# EasyEDA Pro project projeto.eprj

# Schematic Schematic1
Board Name: Board1; Create Date: 2025-10-07; Page Name: P1; Project Name: projeto; Schematic Name: Schematic1; Update Date: 2025-10-07; Company: EasyEDA.com; Page Size: A4; Version: V1.0
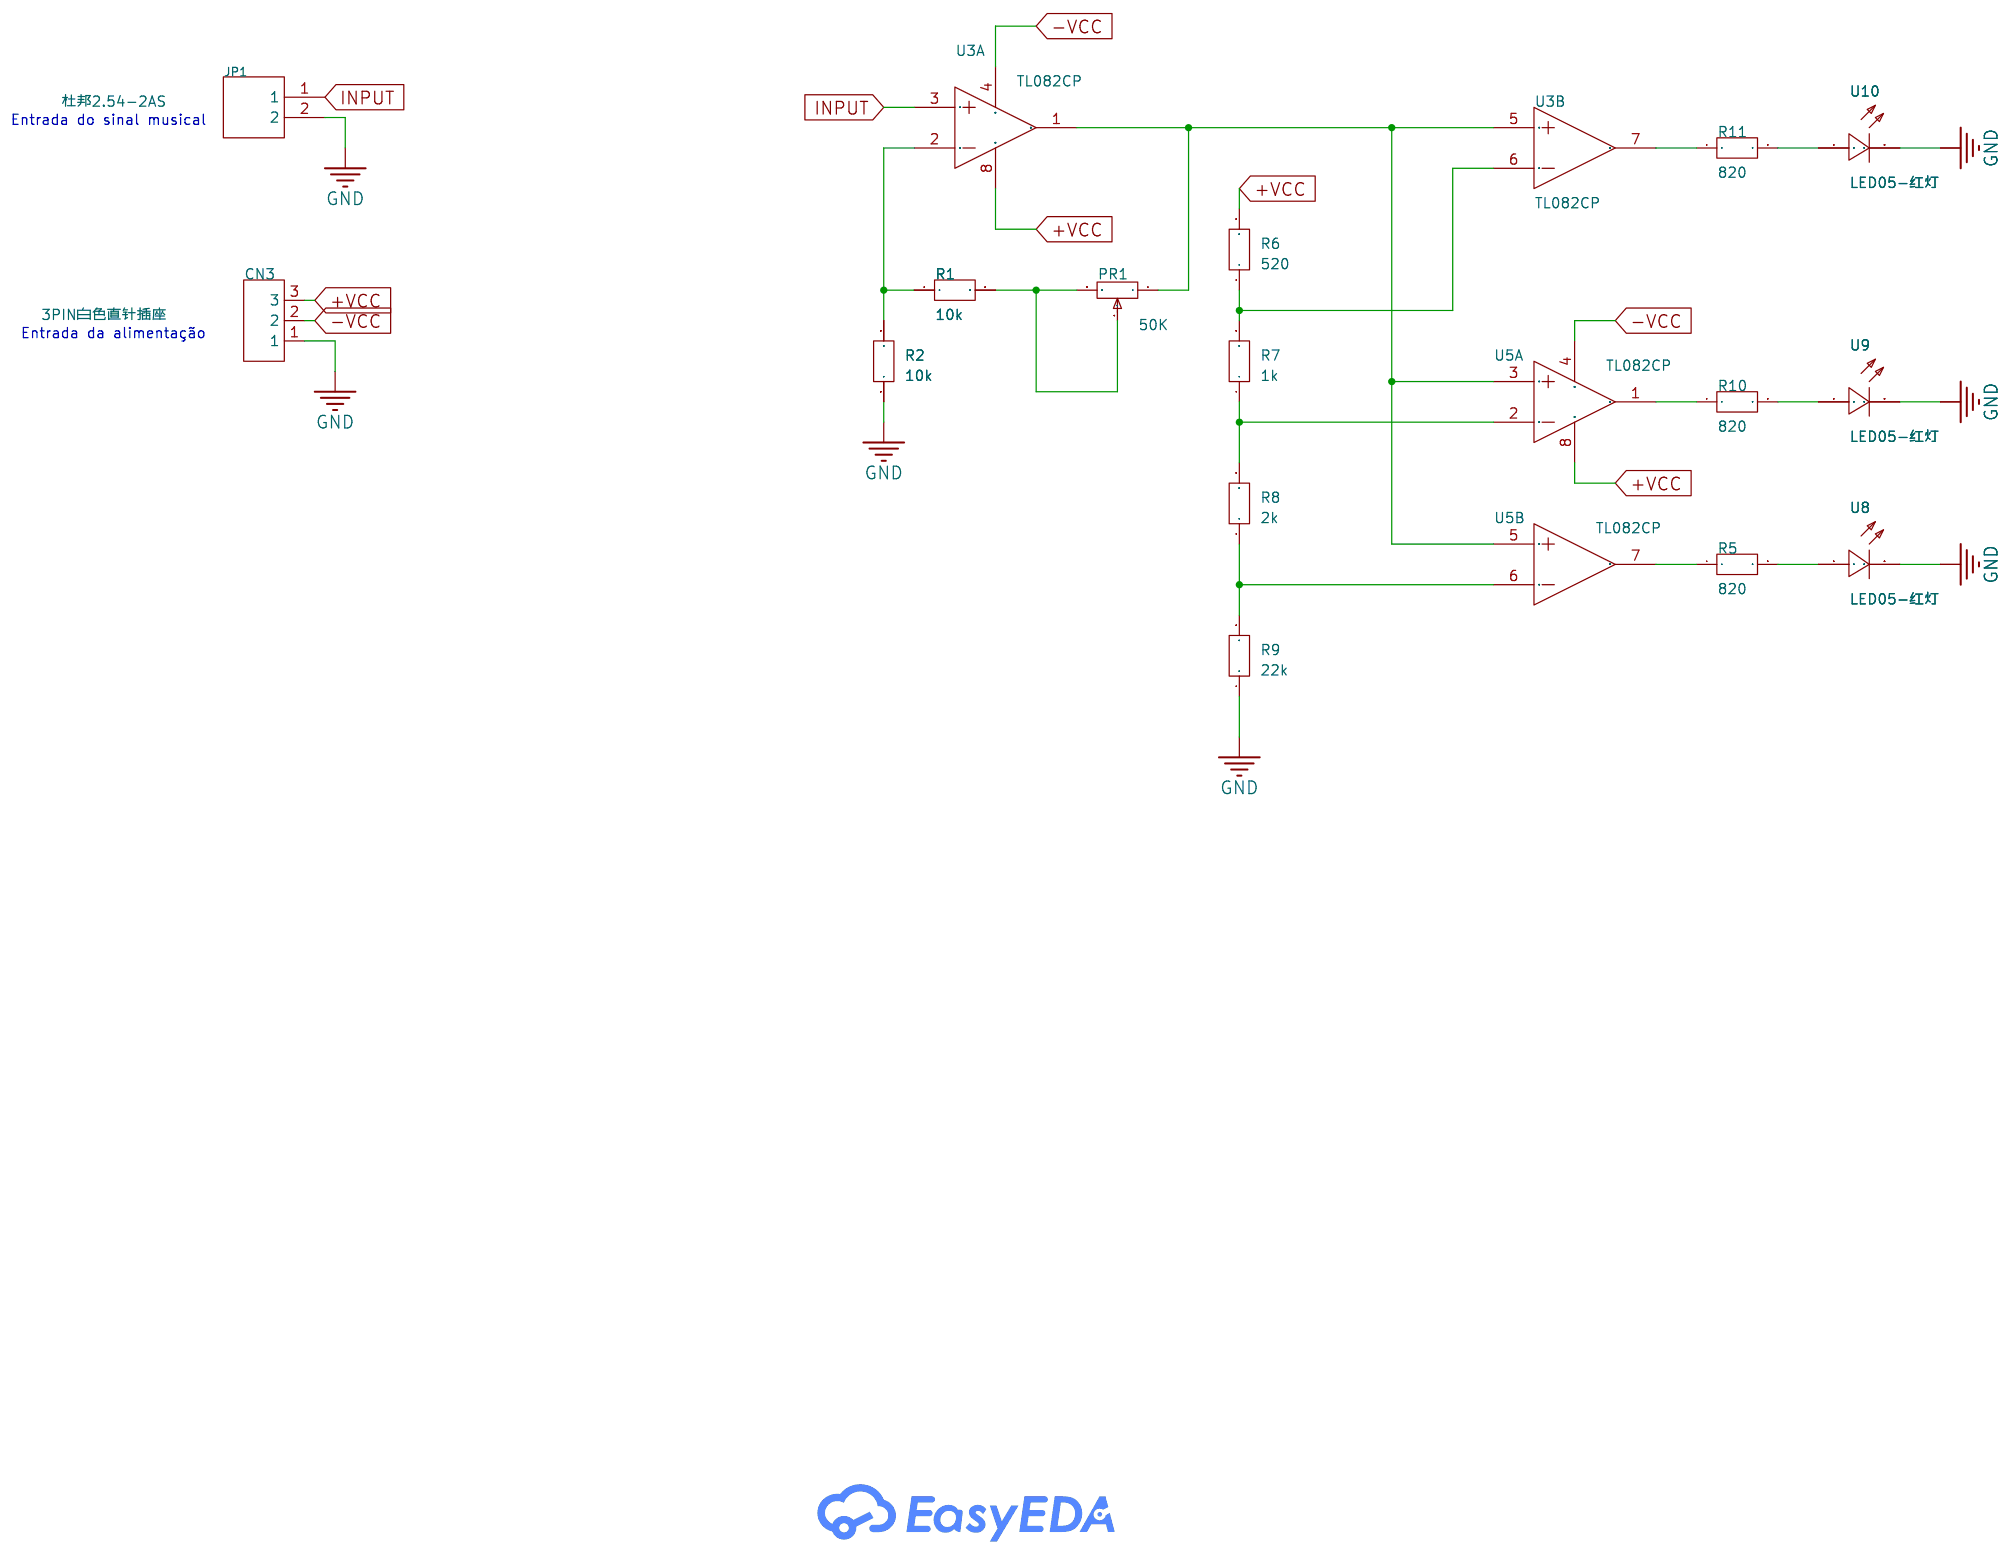
[diagram p0: schematic sheet]

## Parts
CN3  3PIN白色直针插座  [CONN-TH_3P-P2.50_3PIN]
JP1  杜邦2.54-2AS  [CONN-TH_2P-L7.6-W6.0-P2.54-V]
PR1  50K  [CONN-TH_3P-P2.50_3PIN]
R1  10k  [RES-TH_BD4.5-L11.5-P15.50-D0.7]
R2  10k  [RES-TH_BD4.5-L11.5-P15.50-D0.7]
R5  820  [RES-TH_BD4.5-L11.5-P15.50-D0.7]
R6  520  [RES-TH_BD4.5-L11.5-P15.50-D0.7]
R7  1k  [RES-TH_BD4.5-L11.5-P15.50-D0.7]
R8  2k  [RES-TH_BD4.5-L11.5-P15.50-D0.7]
R9  22k  [RES-TH_BD4.5-L11.5-P15.50-D0.7]
R10  820  [RES-TH_BD4.5-L11.5-P15.50-D0.7]
R11  820  [RES-TH_BD4.5-L11.5-P15.50-D0.7]
U3  TL082CP  [PDIP-8_L9.6-W6.4-P2.54-LS7.6-BL]  (sections 1,2)
U5  TL082CP  [PDIP-8_L9.6-W6.4-P2.54-LS7.6-BL]  (sections 1,2)
U8  LED05-红灯  [LED-TH_LED-3MM_RED]
U9  LED05-红灯  [LED-TH_LED-3MM_RED]
U10  LED05-红灯  [LED-TH_LED-3MM_RED]

## Library data of the parts
CN3 = 3PIN白色直针插座: Supplier Part: C9900004958; Supplier Footprint: XH2.54MM; JLCPCB Part Class: Extended Part; Supplier: LCSC
JP1 = 杜邦2.54-2AS: LCSC Part Name: 1x2P 间距:2.54mm 直插; Supplier Part: C50129; Manufacturer: BOOMELE(博穆精密); Supplier Footprint: 插件,P=2.54mm; JLCPCB Part Class: Extended Part; Datasheet: https://item.szlcsc.com/datasheet/%25E6%259D%259C%25E9%2582%25A62.54-2AS/51138.html; Supplier: LCSC; Pins Structure: 1x2P; Pitch: 2.54mm; Mounting Type: Through Hole; Number of Pins: 2P; Number of Rows: 1; Number of PINs Per Row: 2; Current Rating: 3A; Operating Temperature: -25℃~+85℃
PR1 = R_3386P: Supplier Footprint: Through
R1 R2 R5-R11 = MOR02SJ075KA10: Supplier Part: C37390378; Manufacturer: UNI-ROYAL(厚声); Supplier Footprint: 插件,D4.5xL11.5mm; Datasheet: https://item.szlcsc.com/datasheet/MOR02SJ075KA10/39119316.html; Supplier: LCSC; Type: Metal Oxide Film Resistor; Tolerance: ±5%; Power(Watts): 2W; Temperature Coefficient: ±350ppm/℃
U3 U5 = TL082CP: LCSC Part Name: JFET 输入运算放大器; Supplier Part: C75052; Manufacturer: TI(德州仪器); Supplier Footprint: DIP-8; JLCPCB Part Class: Extended Part; Datasheet: https://www.ti.com/cn/lit/gpn/tl082; Supplier: LCSC; Number of Circuits: Dual channel; Gain Bandwidth Product(GBP): 3MHz; Current - Input Bias(Ib): 30pA; Voltage - Input Offset(Vos): 5mV; Slew Rate(SR): 13V/us; Supply Voltage: 5V~15V; Supply Current Per Channel: 1.4mA; Output Current: 2.8mA; Operating Temperature: 0℃~+70℃
U8-U10 = LED05-红灯: Supplier Part: C9900009041; Supplier Footprint: THrough hole; JLCPCB Part Class: Extended Part; Supplier: LCSC

## Nets
+VCC: CN3.3 R6.2 U3.8(VCC+) U5.8(VCC+)
-VCC: CN3.2 U3.4(VCC-) U5.4(VCC-)
GND: CN3.1 JP1.2 R2.1 R9.1 U8.2 U9.2 U10.2
INPUT: JP1.1 U3.3(IN1+)
$1N1297: PR1.2 PR1.3 R1.2
$1N1317: R1.1 R2.2 U3.2(IN1-)
$1N1323: PR1.1 U3.1(OUT1) U3.5(IN2+) U5.3(IN1+) U5.5(IN2+)
$1N1988: R5.1 U5.7(OUT2)
$1N2063: R6.1 R7.2 U3.6(IN2-)
$1N2071: R7.1 R8.2 U5.2(IN1-)
$1N2146: R8.1 R9.2 U5.6(IN2-)
$1N2434: R5.2 U8.1
$1N2538: R10.1 U5.1(OUT1)
$1N2540: R10.2 U9.1
$1N2621: R11.1 U3.7(OUT2)
$1N2623: R11.2 U10.1

## Notes on the sheet
- Entrada do sinal musical
- Entrada da alimentação

# Board PCB1
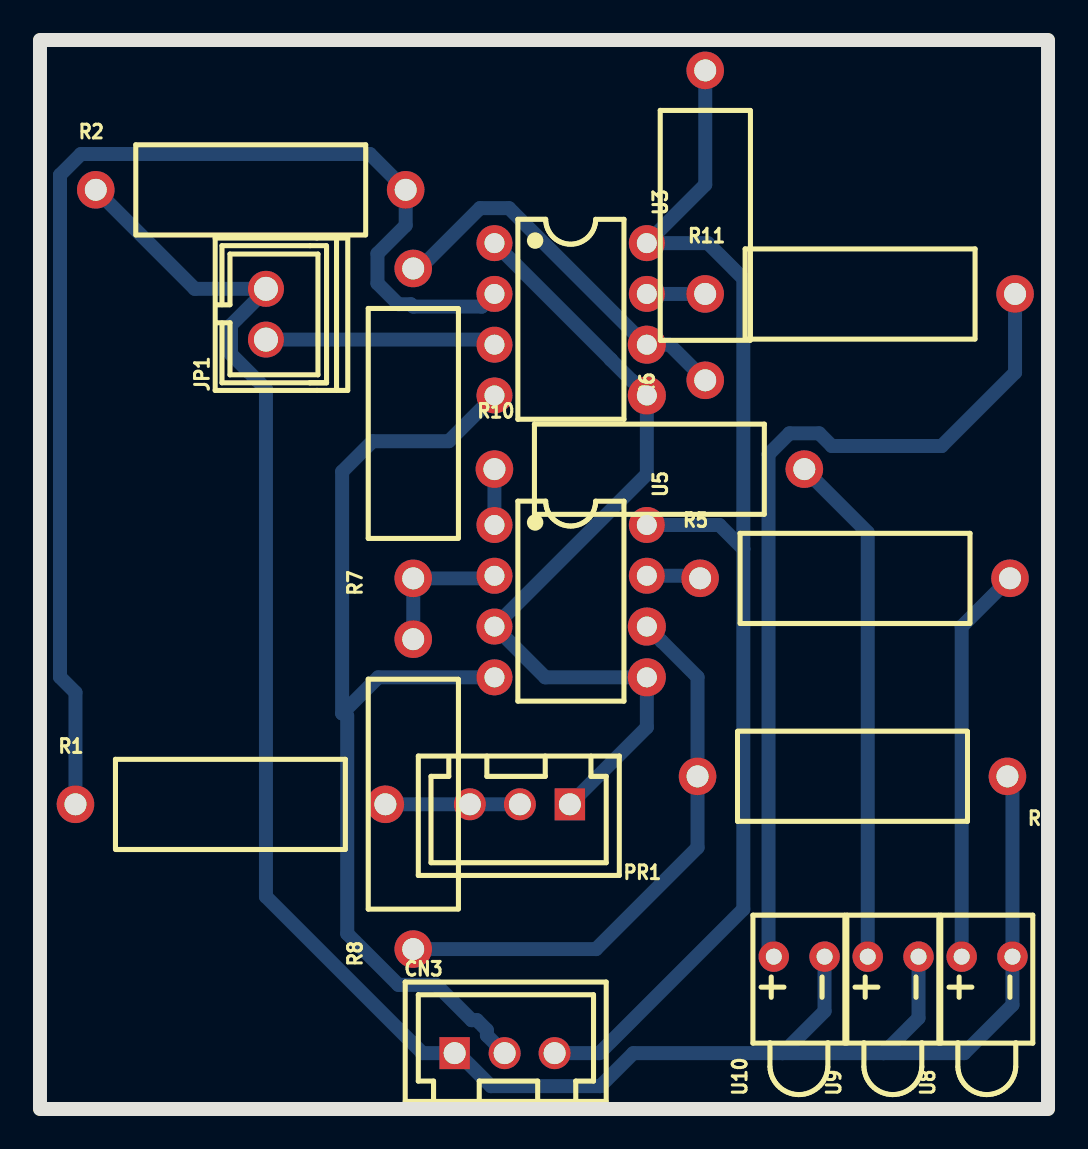
[diagram p1: board, top side]
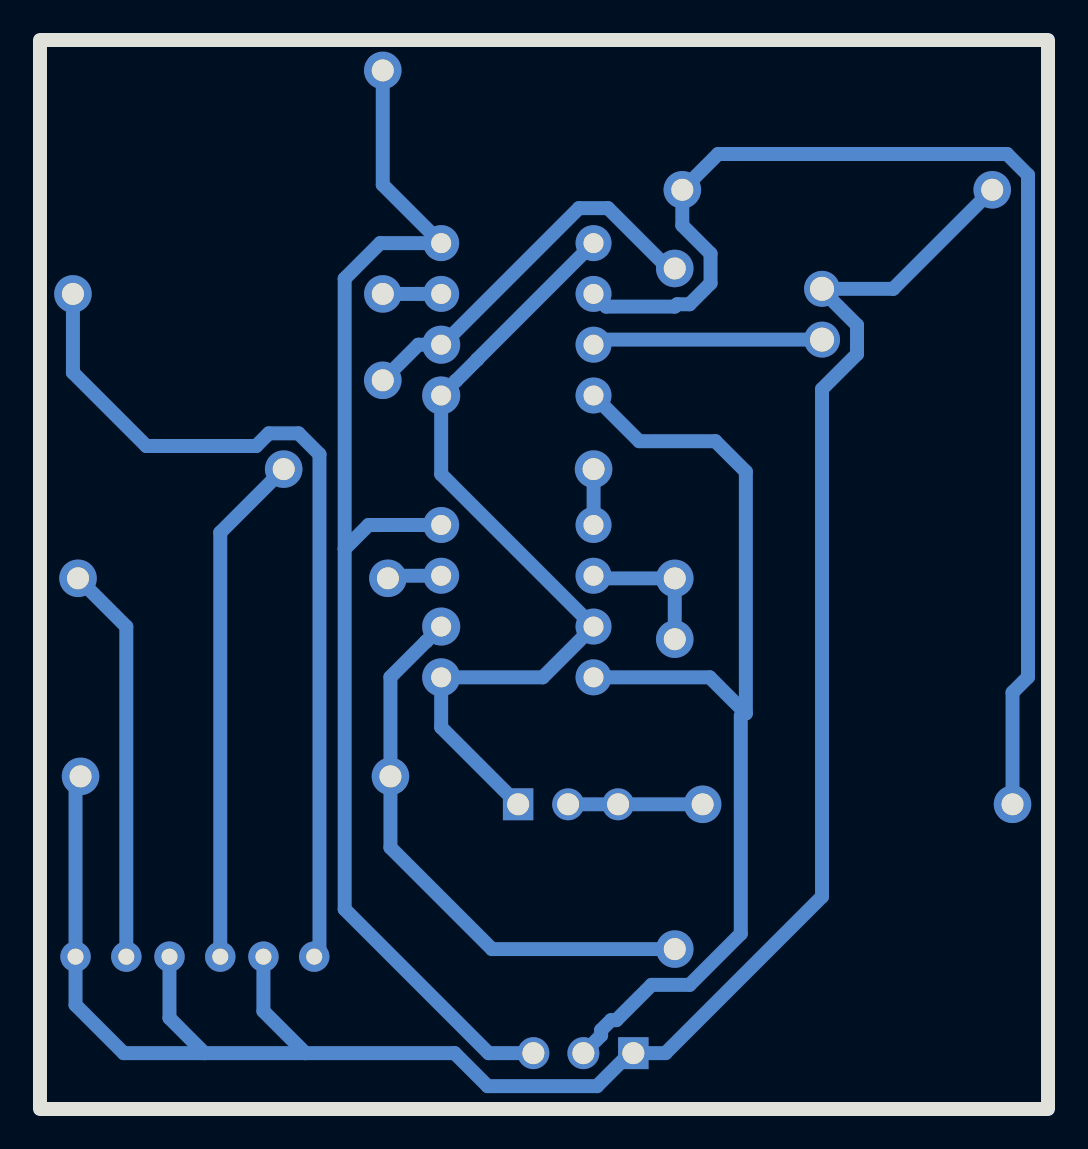
[diagram p2: board, bottom side, seen from below]

Outline 50.42 x 53.47 mm; copper layers: Top Layer, Bottom Layer. Coordinates in mm from the lower left corner of the outline.
Outline path: rectangle 0,53.47 50.42,0
Stack: Top Layer 0.035mm / Dielectric1 1.51mm FR4 er 4.5 / Bottom Layer 0.035mm

## Design rules (mm)
template: Custom Config
spacing copperThickness1oz (default): track to track 0.5, other pairs 0.5 to 0.5
spacing copperThickness2oz: track to track 0.203, other pairs 0.152 to 0.3
track width copperThickness1oz (default): min 0.7, default 0.7, max 2.54
track width copperThickness2oz: min 0.203, default 0.254, max 2.54
differential pair differentialPair (default): width min 0.127, default 0.254, max 2.54; gap min 0.152, default 0.152
via viaSize (default): diameter min 0.5, default 0.61, max 10; hole min 0.3, default 0.305, max 6.3

## Placement (name value [footprint] x y rotation side)
CN3  3PIN白色直针插座  [CONN-TH_3P-P2.50_3PIN]  23.24 2.79 0 top
JP1  杜邦2.54-2AS  [CONN-TH_2P-L7.6-W6.0-P2.54-V]  11.3 39.75 90 top
PR1  50K  [CONN-TH_3P-P2.50_3PIN]  24 15.24 180 top
R1  10k  [RES-TH_BD4.5-L11.5-P15.50-D0.7]  9.52 15.24 0 top
R2  10k  [RES-TH_BD4.5-L11.5-P15.50-D0.7]  10.54 45.97 0 top
R5  820  [RES-TH_BD4.5-L11.5-P15.50-D0.7]  40.77 26.54 0 top
R6  520  [RES-TH_BD4.5-L11.5-P15.50-D0.7]  33.27 44.2 90 top
R7  1k  [RES-TH_BD4.5-L11.5-P15.50-D0.7]  18.67 34.29 90 top
R8  2k  [RES-TH_BD4.5-L11.5-P15.50-D0.7]  18.67 15.75 90 top
R9  22k  [RES-TH_BD4.5-L11.5-P15.50-D0.7]  40.64 16.64 180 top
R10  820  [RES-TH_BD4.5-L11.5-P15.50-D0.7]  30.48 32 0 top
R11  820  [RES-TH_BD4.5-L11.5-P15.50-D0.7]  41.02 40.77 0 top
U3  TL082CP  [PDIP-8_L9.6-W6.4-P2.54-LS7.6-BL]  26.54 39.5 270 top
U5  TL082CP  [PDIP-8_L9.6-W6.4-P2.54-LS7.6-BL]  26.54 25.4 270 top
U8  LED05-红灯  [LED-TH_LED-3MM_RED]  47.37 7.62 90 top
U9  LED05-红灯  [LED-TH_LED-3MM_RED]  42.67 7.62 90 top
U10  LED05-红灯  [LED-TH_LED-3MM_RED]  37.97 7.62 90 top

## Footprints (pads in the part's own frame, mm; a bottom-side part is the same pattern mirrored in y, then rotated)
CONN-TH_2P-L7.6-W6.0-P2.54-V
  round 1.8 hole 1.2: 1(-1.27,0) 2(1.27,0)
CONN-TH_3P-P2.50_3PIN
  rect 1.524x1.6 hole 1.1: 1(-2.5,0)
  round 1.6 hole 1.1: 2(0,0) 3(2.5,0)
LED-TH_LED-3MM_RED
  round 1.524 hole 0.8: 1(0,1.27) 2(0,-1.27)
PDIP-8_L9.6-W6.4-P2.54-LS7.6-BL
  round 1.8 hole 1: 1(-3.81,-3.81) 2(-1.27,-3.81) 3(1.27,-3.81) 4(3.81,-3.81) 7(-1.27,3.81) 8(-3.81,3.81)
  round 1.905 hole 1: 5(3.81,3.81) 6(1.27,3.81)
RES-TH_BD4.5-L11.5-P15.50-D0.7
  round 1.879 hole 1.1: 1(-7.75,0) 2(7.75,0)

## Nets
As in the schematic.

## Routing (per net, layer and track width the routed paths; a pad name or vN(x,y) marks a point on that pad's centre or on a via; arc(x,y) is an arc through that point)
+VCC: length 64.7
  Bottom Layer w0.7: R6.2 33.27,46.23 U3.8 33.4,43.31 35.18,41.53 35.18,28.01 ; CN3.3 27.98,2.79 35.18,9.99 35.18,28.01 ; U5.8 33.98,29.21 35.18,28.01
-VCC: length 51.1
  Bottom Layer w0.7: CN3.2 22.35,3.68 22.35,3.95 21.86,4.44 21.59,4.44 19.83,6.21 17.93,6.21 15.37,8.77 15.37,19.68 ; U5.4 16.92,21.59 15.11,19.78 15.11,31.88 16.64,33.4 20.45,33.4 U3.4
GND: length 108.1
  Bottom Layer w0.7: 42.19,2.79 46.23,2.79 48.64,5.21 U8.2 48.64,16.39 R9.1 ; 42.19,2.79 37.14,2.79 ; 42.19,2.79 43.94,4.55 U9.2 ; 37.14,2.79 29.68,2.79 28.03,1.14 22.56,1.14 20.91,2.79 CN3.1 19.13,2.79 11.3,10.62 11.3,36.01 9.55,37.76 9.55,39.21 11.3,40.96 JP1.2 7.74,41.02 R2.1 ; 37.14,2.79 39.24,4.89 U10.2
INPUT: length 11.5
  Bottom Layer w0.7: U3.3 22.48,38.48 JP1.1
$1N1297: length 6.7
  Bottom Layer w0.7: R1.2 PR1.3 PR1.2
$1N1317: length 62.1
  Bottom Layer w0.7: U3.2 22.1,40.13 18.67,40.13 18.55,40.25 17.93,40.25 16.88,41.3 16.88,42.78 18.29,44.19 R2.2 16.5,47.76 2.05,47.76 1,46.72 1,21.6 1.77,20.83 R1.1
$1N1323: length 42.1
  Bottom Layer w0.7: PR1.1 30.35,19.09 U5.5 25.27,21.59 U5.3 30.35,31.75 U3.5 29.62,36.42 29.61,36.42 28.55,37.48 28.55,37.49 U3.1
$1N1988: length 2.7
  Bottom Layer w0.7: R5.1 32.89,26.67 U5.7
$1N2063: length 19.4
  Bottom Layer w0.7: R7.2 18.99,42.04 22.01,45.06 23.46,45.06 30.29,38.23 U3.6 31.49,38.23 R6.1
$1N2071: length 7.2
  Bottom Layer w0.7: R8.2 R7.1 22.6,26.54 U5.2
$1N2146: length 28.4
  Bottom Layer w0.7: R8.1 27.81,8 32.89,13.08 R9.2 32.89,21.6 31.1,23.39 31.09,23.39 U5.6
$1N2434: length 19.9
  Bottom Layer w0.7: R5.2 46.1,24.13 U8.1
$1N2538: length 2.8
  Bottom Layer w0.7: U5.1 22.73,29.21 R10.1
$1N2540: length 25.7
  Bottom Layer w0.7: U9.1 41.4,28.83 R10.2
$1N2621: length 2.9
  Bottom Layer w0.7: U3.7 R11.1
$1N2623: length 43.7
  Bottom Layer w0.7: R11.2 48.77,36.83 45.1,33.16 39.61,33.16 38.97,33.79 37.49,33.79 36.44,32.75 36.44,7.88 U10.1
